# EAGLE schematic touche_server (EAGLE 9.6.2)
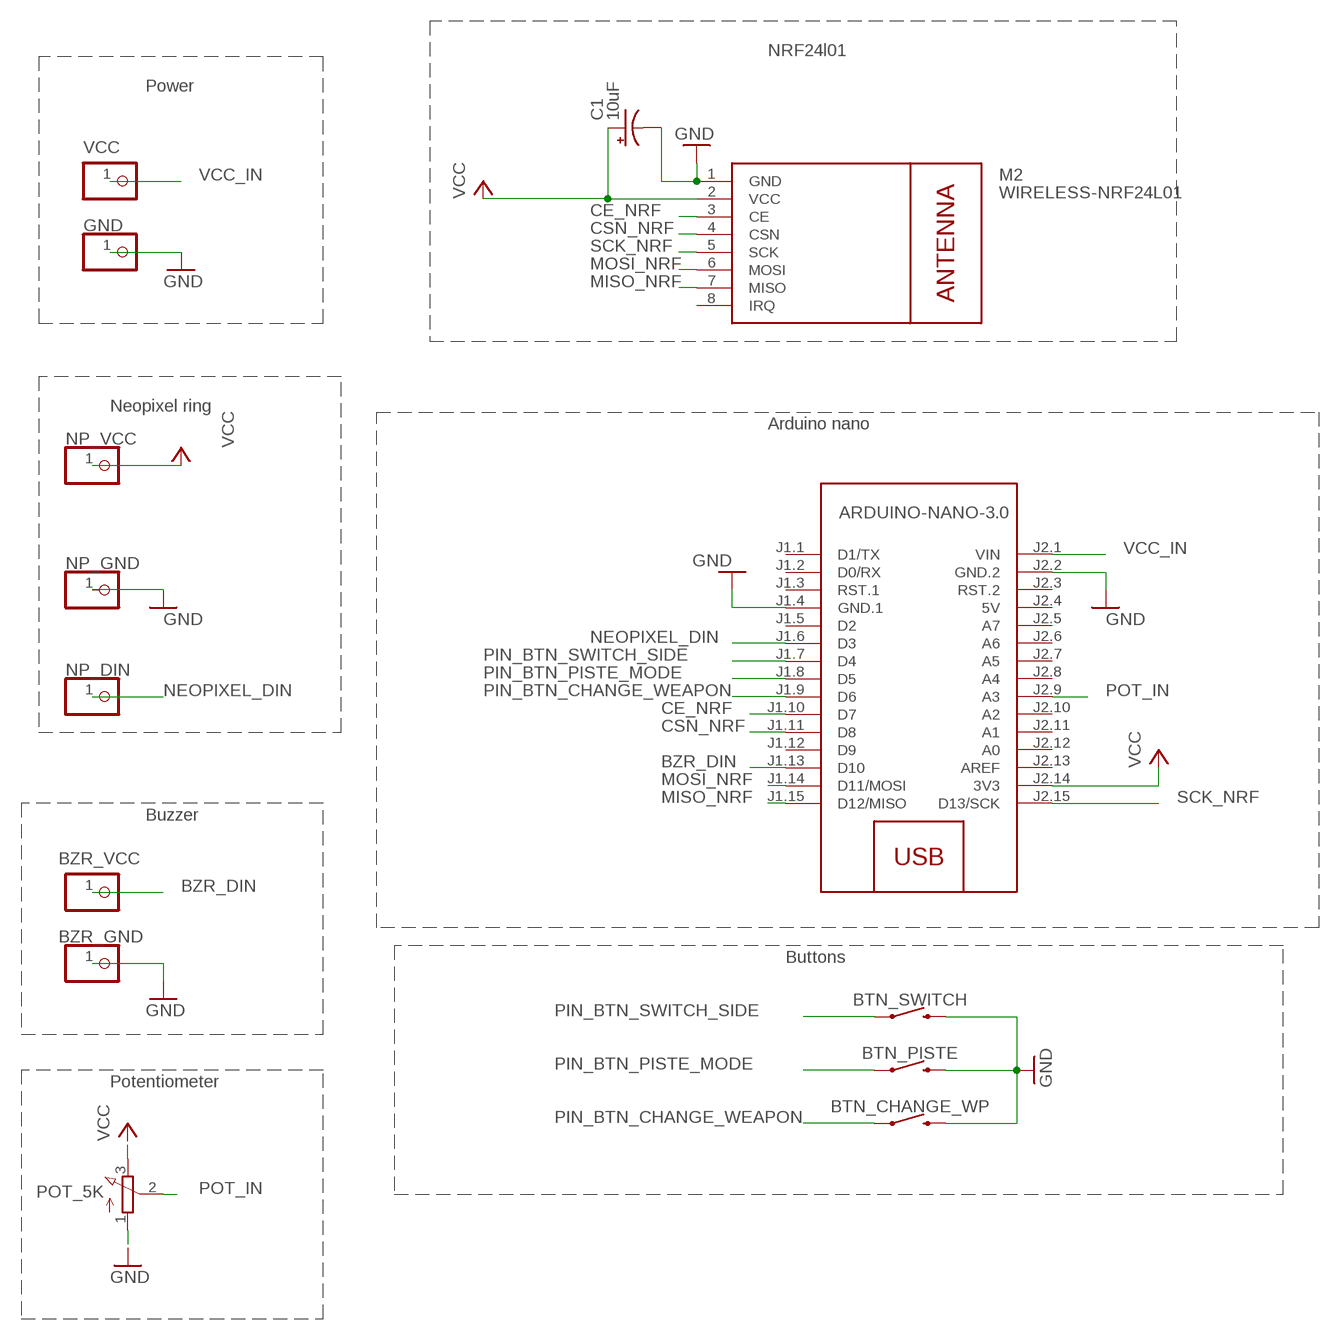
[diagram p0: schematic, sheet 1]

## Parts
BTN_CHANGE_WP  MOMENTARY-SWITCH-SPST-PTH-RIGHT-ANGLE-KIT  [TACTILE_SWITCH_PTH_RIGHT_ANGLE_KIT]
BTN_PISTE  MOMENTARY-SWITCH-SPST-PTH-RIGHT-ANGLE-KIT  [TACTILE_SWITCH_PTH_RIGHT_ANGLE_KIT]
BTN_SWITCH  MOMENTARY-SWITCH-SPST-PTH-RIGHT-ANGLE-KIT  [TACTILE_SWITCH_PTH_RIGHT_ANGLE_KIT]
BZR_GND  BZR_GND  PINHD-1X1  [1X01]
BZR_VCC  BZR_VCC  PINHD-1X1  [1X01]
C1  10uF  CPOL-USE2-5  [E2-5]
GND  GND  PINHD-1X1  [1X01]
M1  ARDUINO-NANO-3.0  [ARDUINO-NANO-3.0]
M2  WIRELESS-NRF24L01  [WIRELESS-NRF24L01]
NP_DIN  NP_DIN  PINHD-1X1  [1X01]
NP_GND  NP_GND  PINHD-1X1  [1X01]
NP_VCC  NP_VCC  PINHD-1X1  [1X01]
POT_5K  3RP/1610N  [3RP/1610N]
VCC  VCC  PINHD-1X1  [1X01]

## Nets
BZR_DIN: BZR_VCC.1 M1.J1.13(D10)
CE_NRF: M1.J1.10(D7) M2.3(CE)
CSN_NRF: M1.J1.11(D8) M2.4(CSN)
GND: BTN_CHANGE_WP.2 BTN_PISTE.2 BTN_SWITCH.2 BZR_GND.1 C1.- GND.1 M1.J1.4(GND.1) M1.J2.2(GND.2) M2.1(GND) NP_GND.1 POT_5K.1(A)
MISO_NRF: M1.J1.15(D12/MISO) M2.7(MISO)
MOSI_NRF: M1.J1.14(D11/MOSI) M2.6(MOSI)
NEOPIXEL_DIN: M1.J1.6(D3) NP_DIN.1
PIN_BTN_CHANGE_WEAPON: BTN_CHANGE_WP.1 M1.J1.9(D6)
PIN_BTN_PISTE_MODE: BTN_PISTE.1 M1.J1.8(D5)
PIN_BTN_SWITCH_SIDE: BTN_SWITCH.1 M1.J1.7(D4)
POT_IN: M1.J2.9(A3) POT_5K.2(S)
SCK_NRF: M1.J2.15(D13/SCK) M2.5(SCK)
VCC: C1.+ M1.J2.14(3V3) M2.2(VCC) NP_VCC.1 POT_5K.3(E)
VCC_IN: M1.J2.1(VIN) VCC.1
Unconnected: M1.J1.1(D1/TX) M1.J1.2(D0/RX) M1.J1.3(RST.1) M1.J1.5(D2) M1.J1.12(D9) M1.J2.3(RST.2) M1.J2.5(A7) M1.J2.6(A6) M1.J2.7(A5) M1.J2.8(A4) M1.J2.10(A2) M1.J2.11(A1) M1.J2.12(A0) M1.J2.13(AREF) M2.8(IRQ)

## Notes on the sheet
- NRF24l01
- Power
- Neopixel ring
- Arduino nano
- Buzzer
- Buttons
- Potentiometer

## Power pins joined to a net without a drawn wire
5V: M1.J2.4(5V)

## Library data of the parts
BTN_CHANGE_WP BTN_PISTE BTN_SWITCH = SparkFun-Switches:MOMENTARY-SWITCH-SPST: Momentary Switch (Pushbutton) - SPST Normally-open (NO) SPST momentary switches (buttons, pushbuttons). Variants PTH-12MM - 12mm square, through-hole Momentary Pushbutton Switch - 12mm Square <https://www.sparkfun.com/products/9190> (COM-09190) PTH-6.0MM, PTH-6.0MM-KIT - 6.0mm square, through-hole Mini Pushbutton Switch <https://www.sparkfun.com/products/97> (COM-00097) KIT package intended for soldering kit's - only one side of pads' copper is exposed. PTH-RIGHT-ANGLE-KIT - Right-angle, through-hole Right Angle Tactile Button <https://www.sparkfun.com/products/10791> - Used on SparkFun BigTime Watch Kit <https://www.sparkfun.com/products/11734> SMD-12MM - 12mm square, surface-mount Tactile Button - SMD (12mm) <https://www.sparkfun.com/products/12993> (COM-12993) Used on SparkFun PicoBoard <https://www.sparkfun.com/products/11888> SMD-4.5MM - 4.5mm Square Trackball Switch Used on SparkFun Blackberry Trackballer Breakout <https://www.sparkfun.com/products/13169> SMD-4.6MMX2.8MM - 4.60mm x 2.80mm, surface mount Used on SparkFun SAMD21 Mini Breakout <https://www.sparkfun.com/products/13664> SMD-5.2MM, SMD-5.2-REDUNDANT - 5.2mm square, surface-mount Mini Pushbutton Switch - SMD <https://www.sparkfun.com/products/8720> (COM-08720) Used on Arduino Pro Mini <https://www.sparkfun.com/products/11114> REDUNDANT package connects both switch circuits together SMD-6.0X3.5MM - 6.0 x 3.5mm, surface mount Momentary Reset Switch SMD <https://www.sparkfun.com/products/8229> (COM-08229) SMD-6.2MM-TALL - 6.2mm square, surface mount Tactile Button - SMD (6mm) <https://www.sparkfun.com/products/12992> Used on SparkFun Digital Sandbox <https://www.sparkfun.com/products/12651> SMD-RIGHT-ANGLE - Right-angle, surface mount Used on SparkFun Block for Intel® Edison - Arduino <https://www.sparkfun.com/products/13036>; PROD_ID: CONN-10672; SF_SKU: COM-10791
BZR_GND BZR_VCC GND NP_DIN NP_GND NP_VCC VCC = pinhead:PINHD-1X1: PIN HEADER
C1 = rcl:CPOL-US: POLARIZED CAPACITOR, American symbol; SPICEPREFIX: C
M1 = wsff_lib:ARDUINO-NANO-3.0: Arduino Nano 3.0 and compatible devices More details available here: https://www.arduino.cc/en/Main/ArduinoBoardNano Click here to find device on ebay.com <http://www.ebay.com/sch/arduino+nano>
M2 = wsff_lib:WIRELESS-NRF24L01: 2.4 GHz Wireless Module based on NRF24L01 chip More details available here: http://www.electrodragon.com/w/NRF24L01 Click here to find device on ebay.com <http://www.ebay.com/sch/nrf24l01+arduino>
POT_5K = pot:3RP/1610N: 16mm Potentiometer one level Source: http://www.alphapotentiometers.net/html/16mm_pot_2.html